# EasyEDA schematic SCH_PCB-micropad_2024-07-05.json
TITLE: Sheet_1; REV: 1.0; Date: 2024-07-03; Sheet: 1/1; Drawn By: projachmann; Company: Your Company
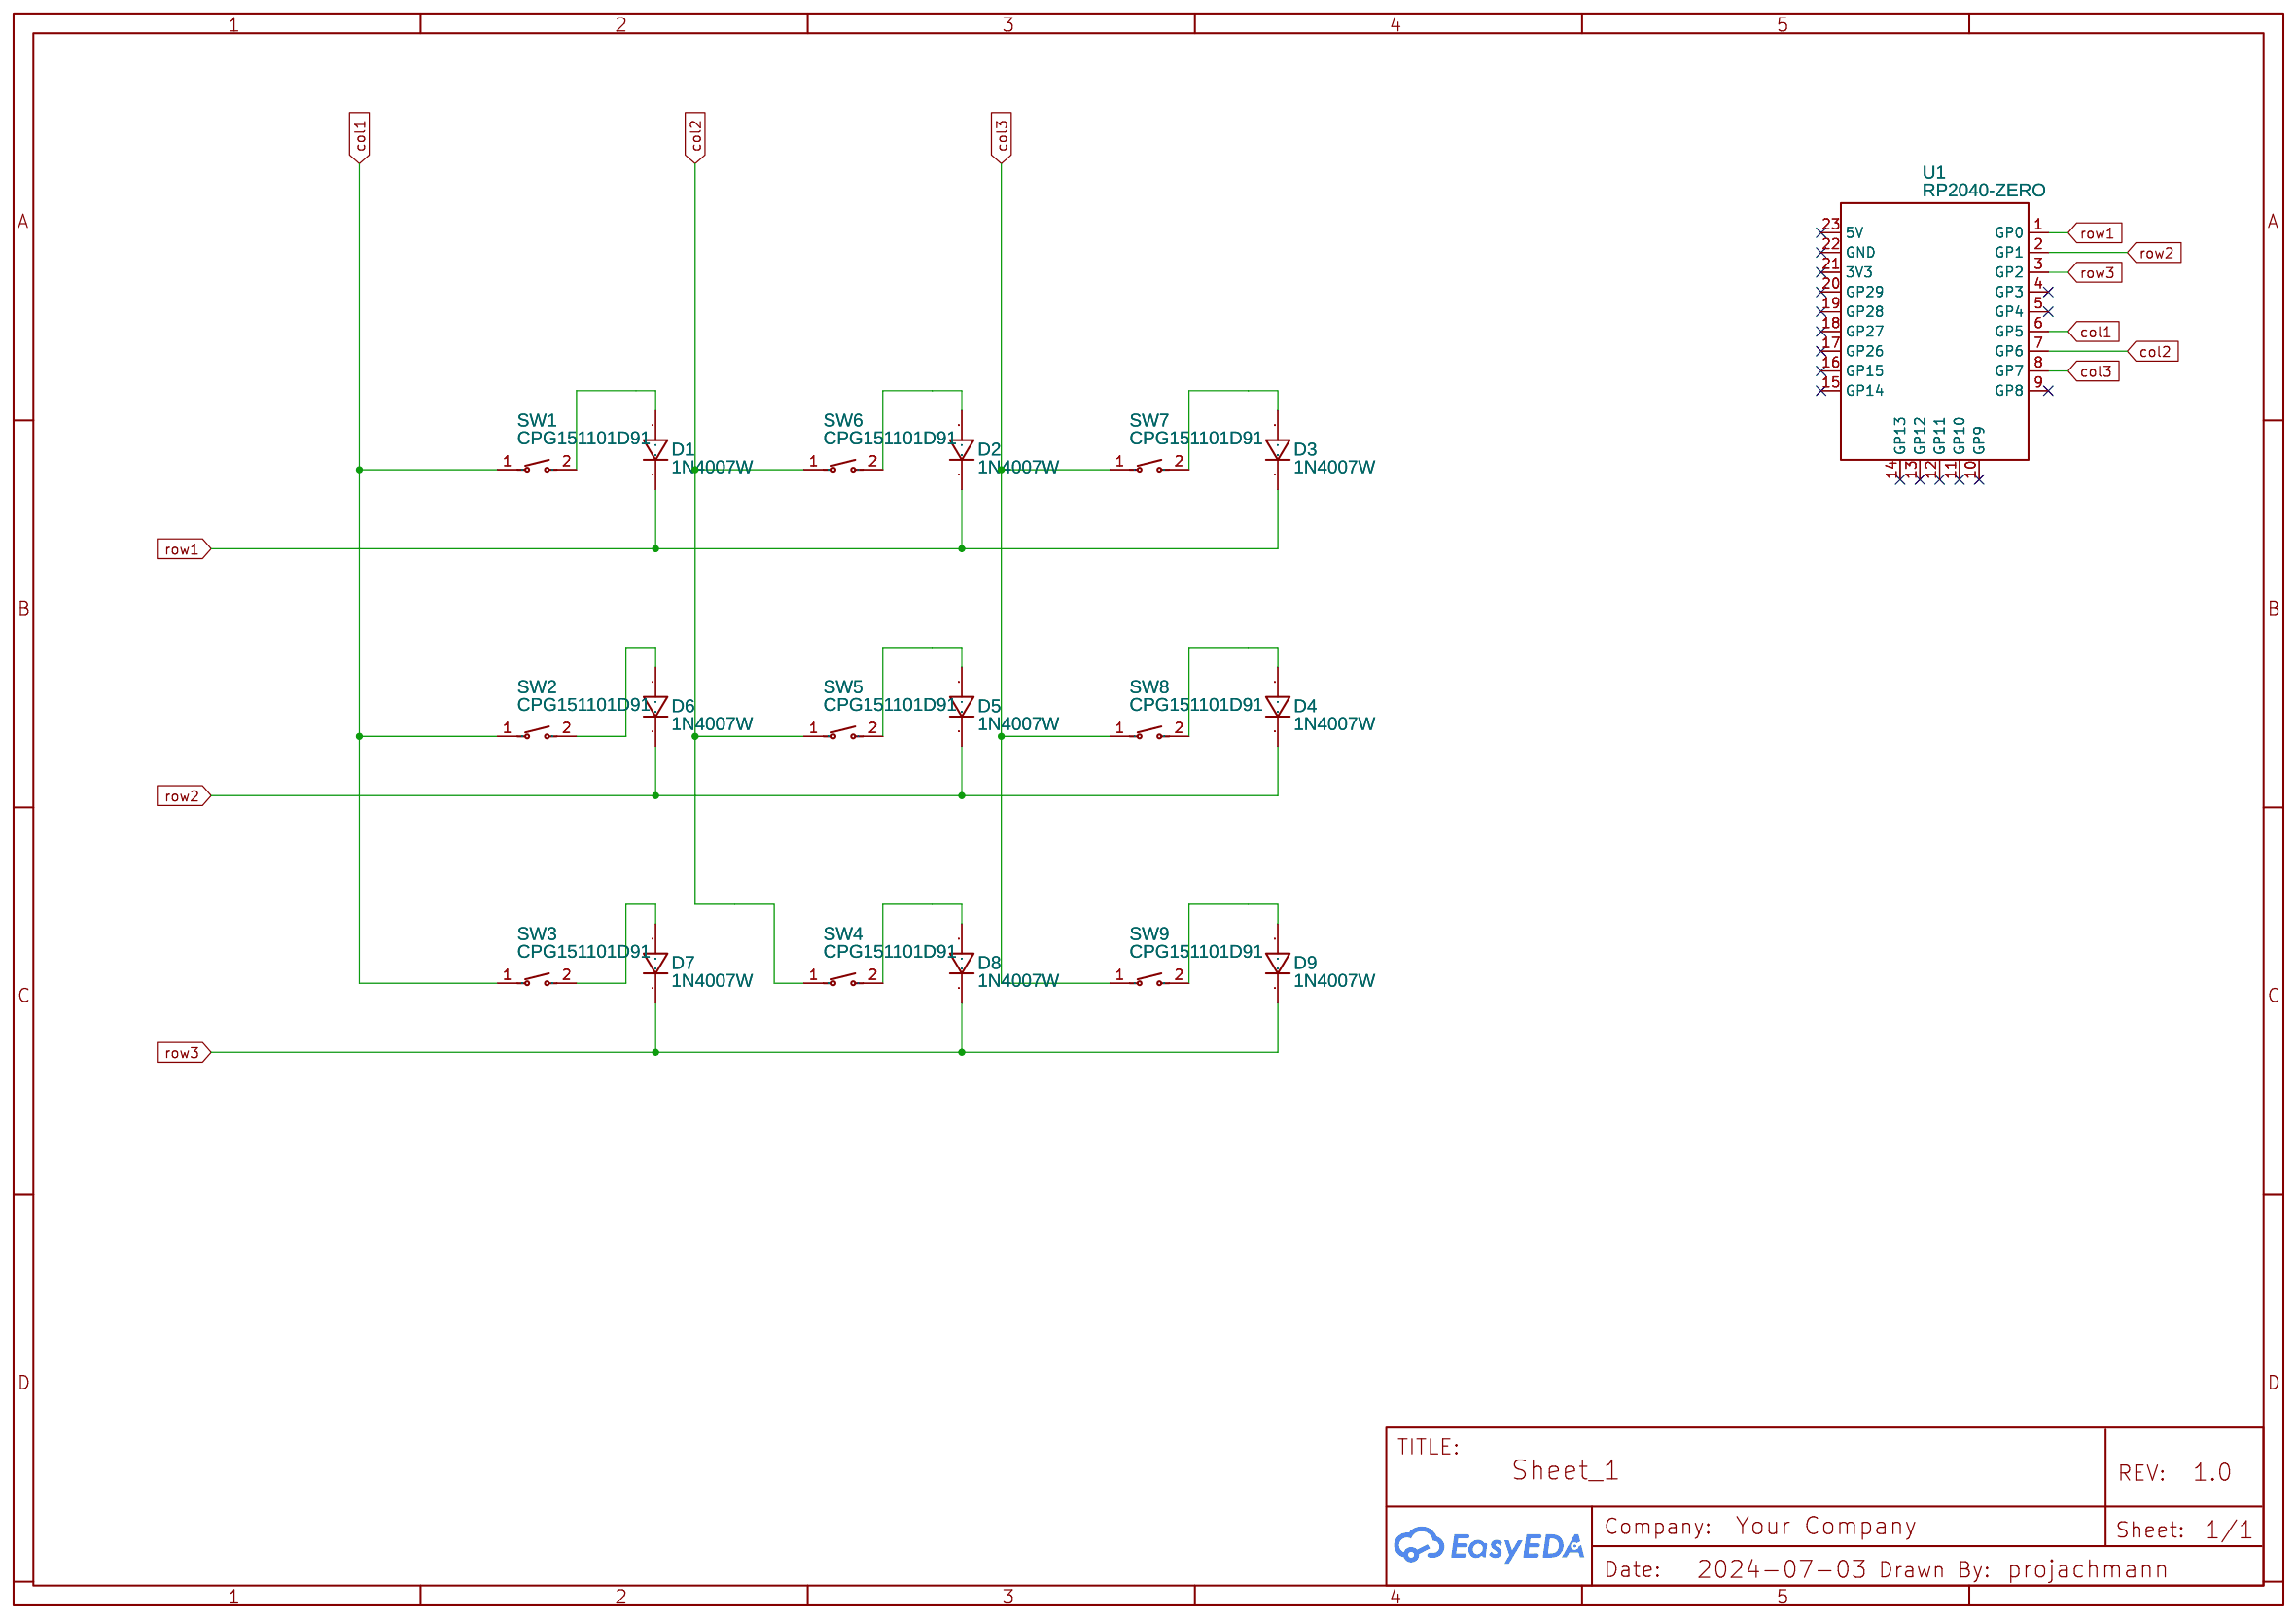
[diagram p0: schematic sheet]

## Parts
D1  1N4007W  [SOD-123_L2.8-W1.8-LS3.7-RD]
D2  1N4007W  [SOD-123_L2.8-W1.8-LS3.7-RD]
D3  1N4007W  [SOD-123_L2.8-W1.8-LS3.7-RD]
D4  1N4007W  [SOD-123_L2.8-W1.8-LS3.7-RD]
D5  1N4007W  [SOD-123_L2.8-W1.8-LS3.7-RD]
D6  1N4007W  [SOD-123_L2.8-W1.8-LS3.7-RD]
D7  1N4007W  [SOD-123_L2.8-W1.8-LS3.7-RD]
D8  1N4007W  [SOD-123_L2.8-W1.8-LS3.7-RD]
D9  1N4007W  [SOD-123_L2.8-W1.8-LS3.7-RD]
SW1  CPG151101D91  [SW-TH_CPG151101D9X]
SW2  CPG151101D91  [SW-TH_CPG151101D9X]
SW3  CPG151101D91  [SW-TH_CPG151101D9X]
SW4  CPG151101D91  [SW-TH_CPG151101D9X]
SW5  CPG151101D91  [SW-TH_CPG151101D9X]
SW6  CPG151101D91  [SW-TH_CPG151101D9X]
SW7  CPG151101D91  [SW-TH_CPG151101D9X]
SW8  CPG151101D91  [SW-TH_CPG151101D9X]
SW9  CPG151101D91  [SW-TH_CPG151101D9X]
U1  RP2040-ZERO  [COMM-SMD_RP2040-ZERO]

## Library data of the parts
D1-D9 = 1N4007W: Supplier: LCSC; Supplier Part: C328592; Manufacturer: BLUE ROCKET; Contributor: LCEDA_Lib
SW1-SW9 = CPG151101D91: Contributor: LCSC; Supplier: LCSC; Supplier Part: C400239; Manufacturer: Kailh(凯华); JLCPCB Part Class: Extended Part
U1 = RP2040-ZERO: Supplier: LCSC; Supplier Part: C5350143; Manufacturer: Waveshare(微雪电子); Manufacturer Part: RP2040-Zero; JLCPCB Part Class: Extended Part; Contributor: lcsc

## Nets
col1: SW1.1 SW2.1 SW3.1 U1.6(GP5)
col2: SW4.1 SW5.1 SW6.1 U1.7(GP6)
col3: SW7.1 SW8.1 SW9.1 U1.8(GP7)
row1: D1.1 D2.1 D3.1 U1.1(GP0)
row2: D4.1 D5.1 D6.1 U1.2(GP1)
row3: D7.1 D8.1 D9.1 U1.3(GP2)
Net-(D1-2): D1.2 SW1.2
Net-(D2-2): D2.2 SW6.2
Net-(D3-2): D3.2 SW7.2
Net-(D4-2): D4.2 SW8.2
Net-(D5-2): D5.2 SW5.2
Net-(D6-2): D6.2 SW2.2
Net-(D7-2): D7.2 SW3.2
Net-(D8-2): D8.2 SW4.2
Net-(D9-2): D9.2 SW9.2

Not connected (* = marked no-connect by the designer): U1 4(GP3)* 5(GP4)* 9(GP8)* 10(GP9)* 11(GP10)* 12(GP11)* 13(GP12)* 14(GP13)* 15(GP14)* 16(GP15)* 17(GP26)* 18(GP27)* 19(GP28)* 20(GP29)* 21(3V3)* 22(GND)* 23(5V)*
